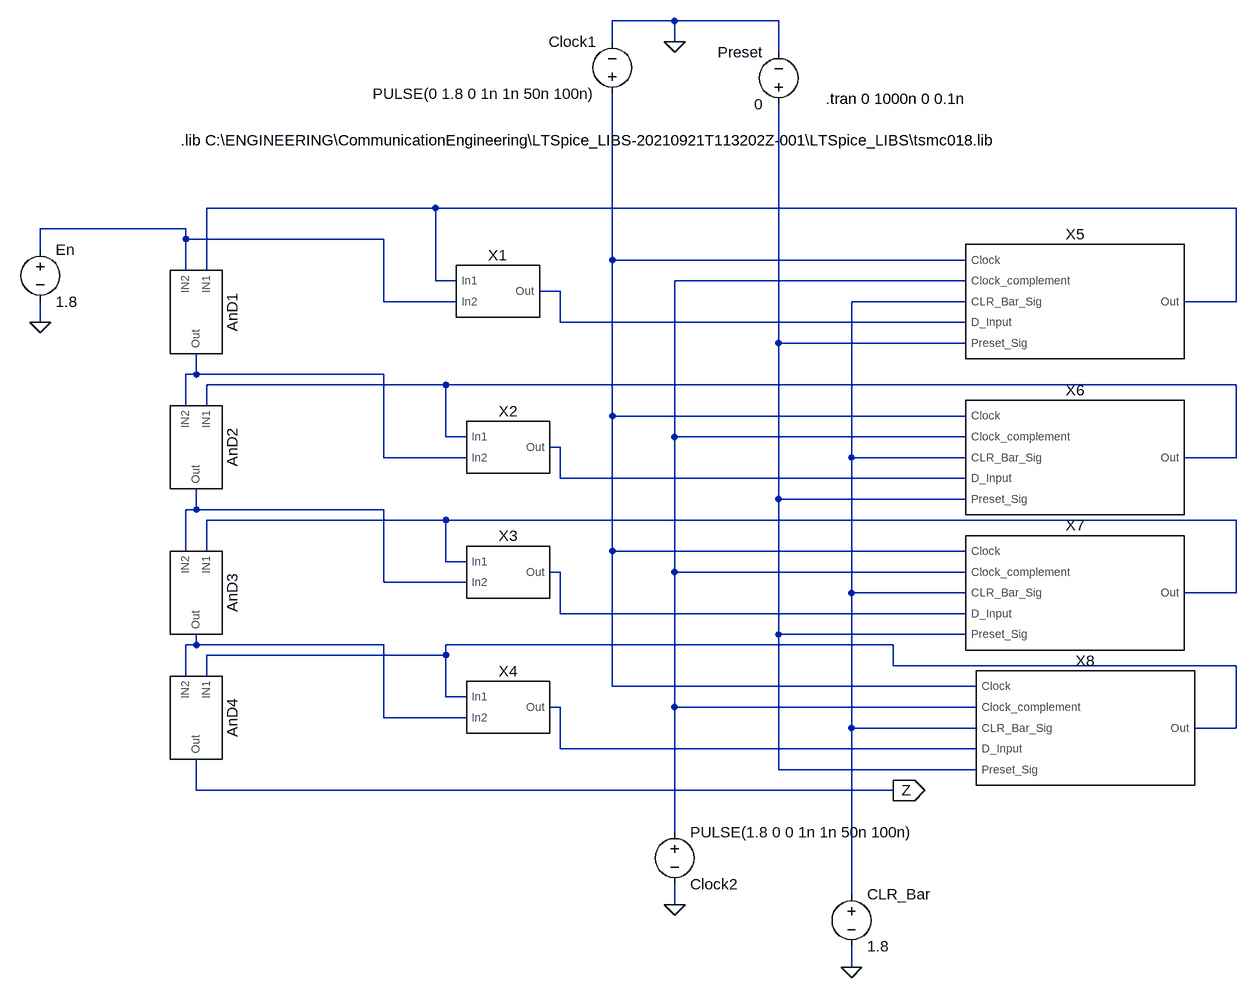
[diagram p0: schematic Counter1.asc]
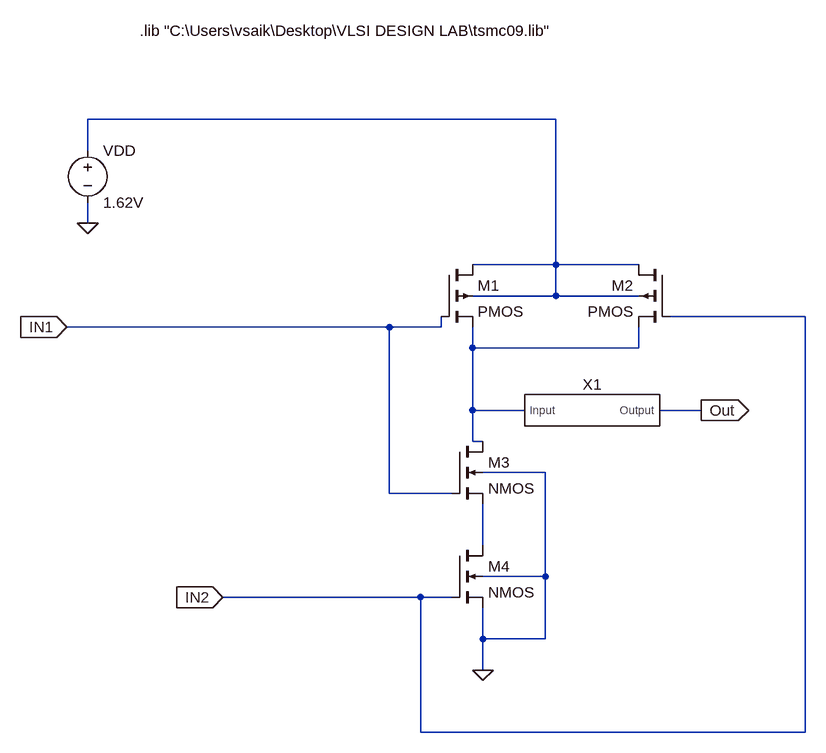
[diagram p1: sub-circuit and_model1.asc]
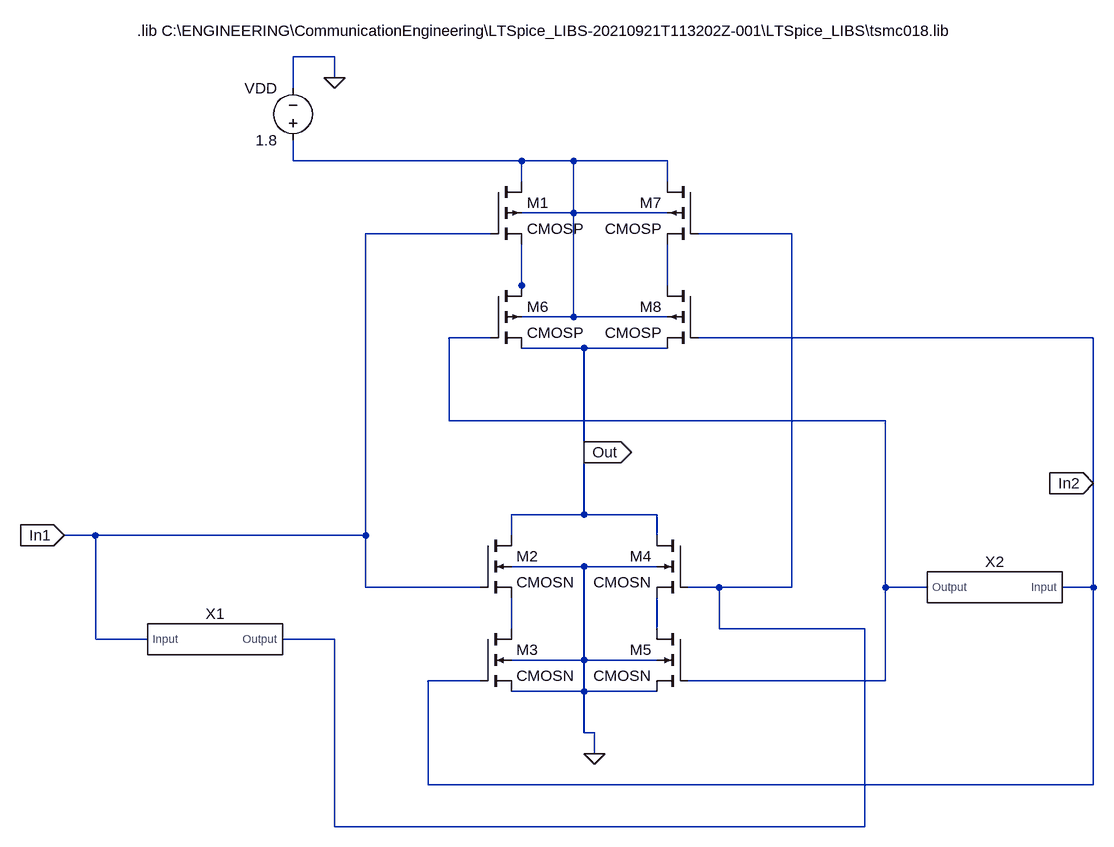
[diagram p2: sub-circuit xor_model1.asc]
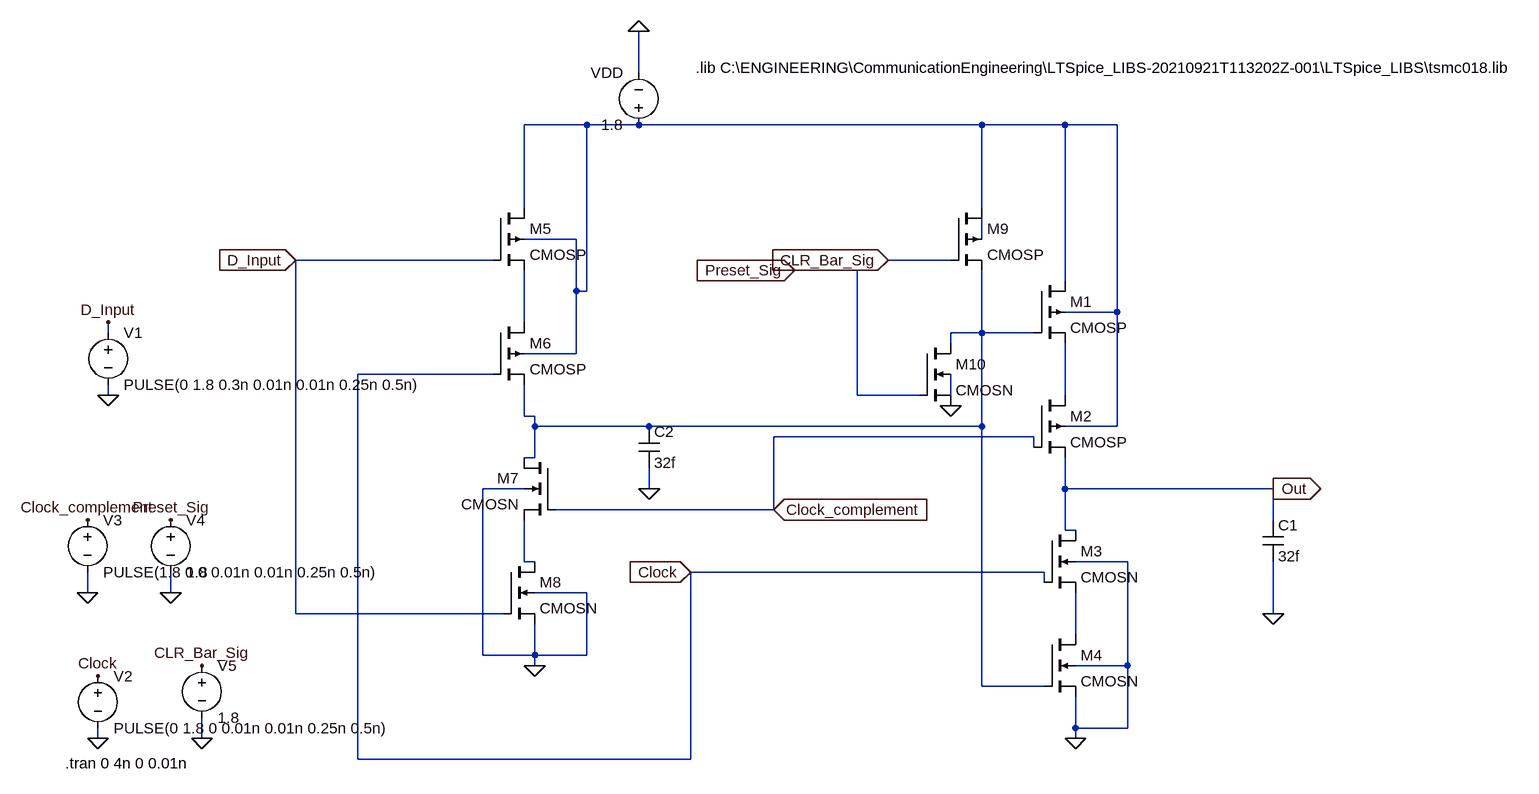
[diagram p3: sub-circuit d_flip_flop_design_pr_clr.asc]
Counter1.asc, the LTspice schematic file:
Version 4
SHEET 1 1284 1268
WIRE 416 -208 320 -208
WIRE 576 -208 416 -208
WIRE 320 -176 320 -208
WIRE 416 -176 416 -208
WIRE 576 -160 576 -208
WIRE 48 80 -304 80
WIRE 1280 80 48 80
WIRE -336 112 -560 112
WIRE -336 128 -336 112
WIRE -32 128 -336 128
WIRE -560 144 -560 112
WIRE 320 160 320 -96
WIRE 864 160 320 160
WIRE -336 176 -336 128
WIRE -304 176 -304 80
WIRE 48 192 48 80
WIRE 80 192 48 192
WIRE 864 192 416 192
WIRE 240 208 208 208
WIRE -32 224 -32 128
WIRE 80 224 -32 224
WIRE 864 224 688 224
WIRE 1280 224 1280 80
WIRE 1280 224 1200 224
WIRE -560 256 -560 224
WIRE 240 256 240 208
WIRE 864 256 240 256
WIRE 576 288 576 -80
WIRE 864 288 576 288
WIRE -320 336 -320 304
WIRE -320 336 -336 336
WIRE -32 336 -320 336
WIRE 64 352 -304 352
WIRE 1280 352 64 352
WIRE -336 384 -336 336
WIRE -304 384 -304 352
WIRE 320 400 320 160
WIRE 864 400 320 400
WIRE 64 432 64 352
WIRE 96 432 64 432
WIRE 416 432 416 192
WIRE 864 432 416 432
WIRE 240 448 224 448
WIRE -32 464 -32 336
WIRE 96 464 -32 464
WIRE 688 464 688 224
WIRE 864 464 688 464
WIRE 1280 464 1280 352
WIRE 1280 464 1200 464
WIRE 240 496 240 448
WIRE 864 496 240 496
WIRE 576 528 576 288
WIRE 864 528 576 528
WIRE -320 544 -320 512
WIRE -320 544 -336 544
WIRE -32 544 -320 544
WIRE 64 560 -304 560
WIRE 1280 560 64 560
WIRE -336 608 -336 544
WIRE -304 608 -304 560
WIRE 320 608 320 400
WIRE 864 608 320 608
WIRE 64 624 64 560
WIRE 96 624 64 624
WIRE 240 640 224 640
WIRE 416 640 416 432
WIRE 864 640 416 640
WIRE -32 656 -32 544
WIRE 96 656 -32 656
WIRE 688 672 688 464
WIRE 864 672 688 672
WIRE 1280 672 1280 560
WIRE 1280 672 1200 672
WIRE 240 704 240 640
WIRE 864 704 240 704
WIRE 576 736 576 528
WIRE 864 736 576 736
WIRE -320 752 -320 736
WIRE -320 752 -336 752
WIRE -32 752 -320 752
WIRE 752 752 64 752
WIRE 64 768 64 752
WIRE 64 768 -304 768
WIRE 752 784 752 752
WIRE 1280 784 752 784
WIRE -336 800 -336 752
WIRE -304 800 -304 768
WIRE 320 816 320 608
WIRE 880 816 320 816
WIRE 64 832 64 768
WIRE 96 832 64 832
WIRE 240 848 224 848
WIRE 416 848 416 640
WIRE 880 848 416 848
WIRE -32 864 -32 752
WIRE 96 864 -32 864
WIRE 688 880 688 672
WIRE 880 880 688 880
WIRE 1280 880 1280 784
WIRE 1280 880 1216 880
WIRE 240 912 240 848
WIRE 880 912 240 912
WIRE 576 944 576 736
WIRE 880 944 576 944
WIRE -320 976 -320 928
WIRE 752 976 -320 976
WIRE 416 1040 416 848
WIRE 688 1136 688 880
WIRE 416 1152 416 1120
WIRE 688 1248 688 1216
FLAG -560 256 0
FLAG 416 -176 0
FLAG 752 976 Z
IOPIN 752 976 Out
FLAG 416 1152 0
FLAG 688 1248 0
SYMBOL AND_model1 -320 240 R90
SYMATTR InstName AnD1
SYMBOL AND_model1 -320 448 R90
SYMATTR InstName AnD2
SYMBOL AND_model1 -320 672 R90
SYMATTR InstName AnD3
SYMBOL AND_model1 -320 864 R90
SYMATTR InstName AnD4
SYMBOL XOR_model1 144 208 R0
SYMATTR InstName X1
SYMBOL XOR_model1 160 448 R0
SYMATTR InstName X2
SYMBOL XOR_model1 160 640 R0
SYMATTR InstName X3
SYMBOL XOR_model1 160 848 R0
SYMATTR InstName X4
SYMBOL voltage -560 128 R0
SYMATTR InstName En
SYMATTR Value 1.8
SYMBOL voltage 320 -80 R180
WINDOW 0 24 96 Left 2
WINDOW 3 24 16 Left 2
WINDOW 123 0 0 Left 0
WINDOW 39 0 0 Left 0
SYMATTR InstName Clock1
SYMATTR Value PULSE(0 1.8 0 1n 1n 50n 100n)
SYMBOL D_Flip_Flop_design_Pr_Clr 1024 224 R0
SYMATTR InstName X5
SYMBOL D_Flip_Flop_design_Pr_Clr 1024 464 R0
SYMATTR InstName X6
SYMBOL D_Flip_Flop_design_Pr_Clr 1024 672 R0
SYMATTR InstName X7
SYMBOL D_Flip_Flop_design_Pr_Clr 1040 880 R0
SYMATTR InstName X8
SYMBOL voltage 416 1024 R0
WINDOW 0 24 96 Left 2
WINDOW 3 24 16 Left 2
WINDOW 123 0 0 Left 0
WINDOW 39 0 0 Left 0
SYMATTR InstName Clock2
SYMATTR Value PULSE(1.8 0 0 1n 1n 50n 100n)
SYMBOL voltage 688 1120 R0
SYMATTR InstName CLR_Bar
SYMATTR Value 1.8
SYMBOL voltage 576 -64 R180
WINDOW 0 24 96 Left 2
WINDOW 3 24 16 Left 2
WINDOW 123 0 0 Left 0
WINDOW 39 0 0 Left 0
SYMATTR InstName Preset
SYMATTR Value 0
TEXT -344 -24 Left 2 !.lib C:\\ENGINEERING\\CommunicationEngineering\\LTSpice_LIBS-20210921T113202Z-001\\LTSpice_LIBS\\tsmc018.lib
TEXT 648 -88 Left 2 !.tran 0 1000n 0 0.1n

and_model1.asc, the sub-circuit schematic file:
Version 4
SHEET 1 1644 1012
WIRE 912 64 192 64
WIRE 192 112 192 64
WIRE 192 224 192 192
WIRE 912 288 912 64
WIRE 912 288 784 288
WIRE 1040 288 912 288
WIRE 912 336 912 288
WIRE 912 336 784 336
WIRE 1040 336 912 336
WIRE 1296 368 1088 368
WIRE 656 384 160 384
WIRE 736 384 736 368
WIRE 736 384 656 384
WIRE 784 416 784 384
WIRE 1040 416 1040 384
WIRE 1040 416 784 416
WIRE 784 512 784 416
WIRE 864 512 784 512
WIRE 1136 512 1072 512
WIRE 784 560 784 512
WIRE 800 560 784 560
WIRE 896 608 800 608
WIRE 656 640 656 384
WIRE 752 640 656 640
WIRE 800 720 800 656
WIRE 896 768 896 608
WIRE 896 768 800 768
WIRE 704 800 400 800
WIRE 752 800 704 800
WIRE 800 864 800 816
WIRE 896 864 896 768
WIRE 896 864 800 864
WIRE 800 912 800 864
WIRE 704 1008 704 800
WIRE 1296 1008 1296 368
WIRE 1296 1008 704 1008
FLAG 192 224 0
FLAG 800 912 0
FLAG 1136 512 Out
IOPIN 1136 512 Out
FLAG 160 384 IN1
IOPIN 160 384 In
FLAG 400 800 IN2
IOPIN 400 800 In
SYMBOL pmos4 736 288 R0
SYMATTR InstName M1
SYMATTR Value2 l=90n w=440n
SYMBOL pmos4 1088 288 M0
SYMATTR InstName M2
SYMATTR Value2 l=90n w=440n
SYMBOL nmos4 752 560 R0
SYMATTR InstName M3
SYMATTR Value2 l=90n w=220n
SYMBOL nmos4 752 720 R0
SYMATTR InstName M4
SYMATTR Value2 l=90n w=220n
SYMBOL voltage 192 96 R0
SYMATTR InstName VDD
SYMATTR Value 1.62V
SYMBOL NOT_model1 960 512 R0
SYMATTR InstName X1
TEXT 272 -72 Left 2 !.lib "C:\\Users\\vsaik\\Desktop\\VLSI DESIGN LAB\\tsmc09.lib"

xor_model1.asc, the sub-circuit schematic file:
Version 4
SHEET 1 2196 1236
WIRE 480 48 416 48
WIRE 480 80 480 48
WIRE 416 96 416 48
WIRE 416 208 416 176
WIRE 768 208 416 208
WIRE 848 208 768 208
WIRE 992 208 848 208
WIRE 768 240 768 208
WIRE 992 240 992 208
WIRE 848 288 848 208
WIRE 848 288 768 288
WIRE 992 288 848 288
WIRE 720 320 528 320
WIRE 1184 320 1040 320
WIRE 768 400 768 336
WIRE 992 400 992 336
WIRE 768 416 768 400
WIRE 848 448 848 288
WIRE 848 448 768 448
WIRE 992 448 848 448
WIRE 720 480 656 480
WIRE 1648 480 1040 480
WIRE 864 496 768 496
WIRE 992 496 864 496
WIRE 656 608 656 480
WIRE 1328 608 656 608
WIRE 864 656 864 496
WIRE 1648 704 1648 480
WIRE 864 752 864 656
WIRE 864 752 752 752
WIRE 976 752 864 752
WIRE 112 784 64 784
WIRE 528 784 528 320
WIRE 528 784 112 784
WIRE 752 784 752 752
WIRE 976 784 976 752
WIRE 864 832 752 832
WIRE 976 832 864 832
WIRE 528 864 528 784
WIRE 704 864 528 864
WIRE 1072 864 1024 864
WIRE 1184 864 1184 320
WIRE 1184 864 1072 864
WIRE 1328 864 1328 608
WIRE 1392 864 1328 864
WIRE 1648 864 1648 704
WIRE 1648 864 1600 864
WIRE 752 928 752 880
WIRE 976 928 976 880
WIRE 1072 928 1072 864
WIRE 1296 928 1072 928
WIRE 112 944 112 784
WIRE 192 944 112 944
WIRE 480 944 400 944
WIRE 864 976 864 832
WIRE 864 976 752 976
WIRE 976 976 864 976
WIRE 704 1008 624 1008
WIRE 1328 1008 1328 864
WIRE 1328 1008 1024 1008
WIRE 864 1024 864 976
WIRE 864 1024 752 1024
WIRE 976 1024 864 1024
WIRE 864 1088 864 1024
WIRE 880 1088 864 1088
WIRE 880 1120 880 1088
WIRE 624 1168 624 1008
WIRE 1648 1168 1648 864
WIRE 1648 1168 624 1168
WIRE 480 1232 480 944
WIRE 1296 1232 1296 928
WIRE 1296 1232 480 1232
FLAG 480 80 0
FLAG 880 1120 0
FLAG 64 784 In1
IOPIN 64 784 In
FLAG 1648 704 In2
IOPIN 1648 704 In
FLAG 864 656 Out
IOPIN 864 656 Out
SYMBOL pmos4 720 240 R0
SYMATTR InstName M1
SYMATTR Value CMOSP
SYMATTR Value2 l=180n w=1320n
SYMBOL nmos4 704 784 R0
SYMATTR InstName M2
SYMATTR Value CMOSN
SYMATTR Value2 l=180n w=440n
SYMBOL nmos4 704 928 R0
SYMATTR InstName M3
SYMATTR Value CMOSN
SYMATTR Value2 l=180n w=440n
SYMBOL nmos4 1024 784 M0
SYMATTR InstName M4
SYMATTR Value CMOSN
SYMATTR Value2 l=180n w=440n
SYMBOL nmos4 1024 928 M0
SYMATTR InstName M5
SYMATTR Value CMOSN
SYMATTR Value2 l=180n w=440n
SYMBOL voltage 416 192 R180
WINDOW 0 24 96 Left 2
WINDOW 3 24 16 Left 2
SYMATTR InstName VDD
SYMATTR Value 1.8
SYMBOL pmos4 720 400 R0
SYMATTR InstName M6
SYMATTR Value CMOSP
SYMATTR Value2 l=180n w=1320n
SYMBOL pmos4 1040 240 M0
SYMATTR InstName M7
SYMATTR Value CMOSP
SYMATTR Value2 l=180n w=1320n
SYMBOL pmos4 1040 400 M0
SYMATTR InstName M8
SYMATTR Value CMOSP
SYMATTR Value2 l=180n w=1320n
SYMBOL NOT_model1 288 944 R0
SYMATTR InstName X1
SYMBOL NOT_model1 1504 864 M0
SYMATTR InstName X2
TEXT 176 8 Left 2 !.lib C:\\ENGINEERING\\CommunicationEngineering\\LTSpice_LIBS-20210921T113202Z-001\\LTSpice_LIBS\\tsmc018.lib

d_flip_flop_design_pr_clr.asc, the sub-circuit schematic file:
Version 4
SHEET 1 1324 1064
WIRE -160 -16 -160 -80
WIRE -240 64 -336 64
WIRE -160 64 -240 64
WIRE 368 64 -160 64
WIRE 496 64 368 64
WIRE 576 64 496 64
WIRE -336 192 -336 64
WIRE 368 192 368 64
WIRE -256 240 -336 240
WIRE 368 240 368 208
WIRE -384 272 -688 272
WIRE 320 272 224 272
WIRE 176 288 80 288
WIRE 496 304 496 64
WIRE -256 320 -256 240
WIRE -240 320 -240 64
WIRE -240 320 -256 320
WIRE 576 352 576 64
WIRE 576 352 496 352
WIRE -336 368 -336 288
WIRE -976 384 -976 368
WIRE 368 384 368 288
WIRE 368 384 320 384
WIRE 448 384 368 384
WIRE 320 400 320 384
WIRE -256 416 -256 320
WIRE -256 416 -336 416
WIRE -384 448 -592 448
WIRE -976 480 -976 464
WIRE 176 480 176 288
WIRE 272 480 176 480
WIRE 320 480 320 448
WIRE 496 480 496 400
WIRE -336 512 -336 464
WIRE -320 512 -336 512
WIRE -320 528 -320 512
WIRE -144 528 -320 528
WIRE 368 528 368 384
WIRE 368 528 -144 528
WIRE 576 528 576 352
WIRE 576 528 496 528
WIRE 448 544 48 544
WIRE 448 560 448 544
WIRE -320 576 -320 528
WIRE -320 576 -336 576
WIRE -336 624 -400 624
WIRE -144 624 -144 592
WIRE 496 624 496 576
WIRE 816 624 496 624
WIRE 48 656 48 544
WIRE 48 656 -288 656
WIRE 816 672 816 624
WIRE 496 688 496 624
WIRE 512 688 496 688
WIRE -336 736 -336 672
WIRE -320 736 -336 736
WIRE 592 736 512 736
WIRE 464 752 -80 752
WIRE 464 768 464 752
WIRE -1008 784 -1008 752
WIRE -880 784 -880 752
WIRE -240 784 -320 784
WIRE -688 816 -688 272
WIRE -368 816 -688 816
WIRE 816 816 816 736
WIRE 512 848 512 784
WIRE -400 880 -400 624
WIRE -320 880 -320 832
WIRE -320 880 -400 880
WIRE -240 880 -240 784
WIRE -240 880 -320 880
WIRE -320 896 -320 880
WIRE 592 896 592 736
WIRE 592 896 512 896
WIRE 368 928 368 528
WIRE 464 928 368 928
WIRE 512 992 512 944
WIRE 592 992 592 896
WIRE 592 992 512 992
WIRE -992 1008 -992 992
WIRE -832 1008 -832 976
WIRE 512 1008 512 992
WIRE -592 1040 -592 448
WIRE -80 1040 -80 752
WIRE -80 1040 -592 1040
FLAG -160 -80 0
FLAG 512 1008 0
FLAG 816 816 0
FLAG -320 896 0
FLAG -144 624 0
FLAG 320 496 0
FLAG 80 288 Preset_Sig
IOPIN 80 288 In
FLAG 224 272 CLR_Bar_Sig
IOPIN 224 272 In
FLAG -80 752 Clock
IOPIN -80 752 In
FLAG -688 272 D_Input
IOPIN -688 272 In
FLAG 48 656 Clock_complement
IOPIN 48 656 In
FLAG 816 624 Out
IOPIN 816 624 Out
FLAG -976 480 0
FLAG -992 1008 0
FLAG -1008 784 0
FLAG -880 784 0
FLAG -976 368 D_Input
FLAG -992 912 Clock
FLAG -1008 672 Clock_complement
FLAG -880 672 Preset_Sig
FLAG -832 1008 0
FLAG -832 896 CLR_Bar_Sig
SYMBOL pmos4 448 304 R0
SYMATTR InstName M1
SYMATTR Value CMOSP
SYMATTR Value2 l=180n w=440n
SYMBOL pmos4 448 480 R0
SYMATTR InstName M2
SYMATTR Value CMOSP
SYMATTR Value2 l=180n w=440n
SYMBOL nmos4 464 688 R0
SYMATTR InstName M3
SYMATTR Value CMOSN
SYMATTR Value2 l=180n w=220n
SYMBOL nmos4 464 848 R0
SYMATTR InstName M4
SYMATTR Value CMOSN
SYMATTR Value2 l=180n w=220n
SYMBOL voltage -160 80 R180
WINDOW 0 24 96 Left 2
WINDOW 3 24 16 Left 2
SYMATTR InstName VDD
SYMATTR Value 1.8
SYMBOL cap 800 672 R0
SYMATTR InstName C1
SYMATTR Value 32f
SYMBOL pmos4 -384 192 R0
SYMATTR InstName M5
SYMATTR Value CMOSP
SYMATTR Value2 l=180n w=440n
SYMBOL pmos4 -384 368 R0
SYMATTR InstName M6
SYMATTR Value CMOSP
SYMATTR Value2 l=180n w=440n
SYMBOL nmos4 -288 576 M0
SYMATTR InstName M7
SYMATTR Value CMOSN
SYMATTR Value2 l=180n w=220n
SYMBOL nmos4 -368 736 R0
SYMATTR InstName M8
SYMATTR Value CMOSN
SYMATTR Value2 l=180n w=220n
SYMBOL cap -160 528 R0
SYMATTR InstName C2
SYMATTR Value 32f
SYMBOL pmos4 320 192 R0
SYMATTR InstName M9
SYMATTR Value CMOSP
SYMATTR Value2 l=180n w=440n
SYMBOL nmos4 272 400 R0
SYMATTR InstName M10
SYMATTR Value CMOSN
SYMATTR Value2 l=180n w=220n
SYMBOL voltage -976 368 R0
WINDOW 123 0 0 Left 0
WINDOW 39 0 0 Left 0
SYMATTR InstName V1
SYMATTR Value PULSE(0 1.8 0.3n 0.01n 0.01n 0.25n 0.5n)
SYMBOL voltage -992 896 R0
WINDOW 123 0 0 Left 0
WINDOW 39 0 0 Left 0
SYMATTR InstName V2
SYMATTR Value PULSE(0 1.8 0 0.01n 0.01n 0.25n 0.5n)
SYMBOL voltage -1008 656 R0
WINDOW 123 0 0 Left 0
WINDOW 39 0 0 Left 0
SYMATTR InstName V3
SYMATTR Value PULSE(1.8 0 0 0.01n 0.01n 0.25n 0.5n)
SYMBOL voltage -880 656 R0
WINDOW 123 0 0 Left 0
WINDOW 39 0 0 Left 0
SYMATTR InstName V4
SYMATTR Value 1.8
SYMBOL voltage -832 880 R0
WINDOW 123 0 0 Left 0
WINDOW 39 0 0 Left 0
SYMATTR InstName V5
SYMATTR Value 1.8
TEXT -72 -24 Left 2 !.lib C:\\ENGINEERING\\CommunicationEngineering\\LTSpice_LIBS-20210921T113202Z-001\\LTSpice_LIBS\\tsmc018.lib
TEXT -1042 1046 Left 2 !.tran 0 4n 0 0.01n

The netlist it stands for:
* Counter1.asc
XAnD1 N001 N002 N008 and_model1
XAnD2 N009 N008 N011 and_model1
XAnD3 N012 N011 N014 and_model1
XAnD4 N015 N014 Z and_model1
XX1 N001 N002 N005 xor_model1
XX2 N009 N008 N010 xor_model1
XX3 N012 N011 N013 xor_model1
XX4 N015 N014 N016 xor_model1
V§En N002 0 1.8
V§Clock1 N003 0 PULSE(0 1.8 0 1n 1n 50n 100n)
XX5 N003 N004 N006 N005 N007 N001 d_flip_flop_design_pr_clr
XX6 N003 N004 N006 N010 N007 N009 d_flip_flop_design_pr_clr
XX7 N003 N004 N006 N013 N007 N012 d_flip_flop_design_pr_clr
XX8 N003 N004 N006 N016 N007 N015 d_flip_flop_design_pr_clr
V§Clock2 N004 0 PULSE(1.8 0 0 1n 1n 50n 100n)
V§CLR_Bar N006 0 1.8
V§Preset N007 0 0

* block symbol definitions
.subckt and_model1 IN1 IN2 Out
M1 N001 IN1 N002 N001 PMOS l=90n w=440n
M2 N001 IN2 N002 N001 PMOS l=90n w=440n
M3 N002 IN1 N003 0 NMOS l=90n w=220n
M4 N003 IN2 0 0 NMOS l=90n w=220n
VDD N001 0 1.62V
XX1 N002 Out NOT0  ; pins Input Output
.lib "C:\Users\vsaik\Desktop\VLSI DESIGN LAB\tsmc09.lib"
.ends and_model1

.subckt xor_model1 In1 In2 Out
M1 N001 In1 N003 N001 CMOSP l=180n w=1320n
M2 Out In1 N006 0 CMOSN l=180n w=440n
M3 N006 In2 0 0 CMOSN l=180n w=440n
M4 Out N002 N007 0 CMOSN l=180n w=440n
M5 N007 N005 0 0 CMOSN l=180n w=440n
VDD N001 0 1.8
M6 N003 N005 Out N001 CMOSP l=180n w=1320n
M7 N001 N002 N004 N001 CMOSP l=180n w=1320n
M8 N004 In2 Out N001 CMOSP l=180n w=1320n
XX1 In1 N002 NOT0  ; pins Input Output
XX2 In2 N005 NOT0  ; pins Input Output
.lib C:\ENGINEERING\CommunicationEngineering\LTSpice_LIBS-20210921T113202Z-001\LTSpice_LIBS\tsmc018.lib
.ends xor_model1

.subckt d_flip_flop_design_pr_clr Clock Clock_complement CLR_Bar_Sig D_Input Preset_Sig Out
M1 N001 N004 N006 N001 CMOSP l=180n w=440n
M2 N006 Clock_complement Out N001 CMOSP l=180n w=440n
M3 Out Clock N008 0 CMOSN l=180n w=220n
M4 N008 N004 0 0 CMOSN l=180n w=220n
VDD N001 0 1.8
C1 Out 0 32f
M5 N001 D_Input N003 N001 CMOSP l=180n w=440n
M6 N003 Clock N004 N001 CMOSP l=180n w=440n
M7 N004 Clock_complement N007 0 CMOSN l=180n w=220n
M8 N007 D_Input 0 0 CMOSN l=180n w=220n
C2 N004 0 32f
M9 N001 CLR_Bar_Sig N004 N002 CMOSP l=180n w=440n
M10 N004 Preset_Sig 0 N005 CMOSN l=180n w=220n
V1 D_Input 0 PULSE(0 1.8 0.3n 0.01n 0.01n 0.25n 0.5n)
V2 Clock 0 PULSE(0 1.8 0 0.01n 0.01n 0.25n 0.5n)
V3 Clock_complement 0 PULSE(1.8 0 0 0.01n 0.01n 0.25n 0.5n)
V4 Preset_Sig 0 1.8
V5 CLR_Bar_Sig 0 1.8
.lib C:\ENGINEERING\CommunicationEngineering\LTSpice_LIBS-20210921T113202Z-001\LTSpice_LIBS\tsmc018.lib
.tran 0 4n 0 0.01n
.ends d_flip_flop_design_pr_clr

.model NMOS NMOS
.model PMOS PMOS
.lib standard.mos
.lib C:\ENGINEERING\CommunicationEngineering\LTSpice_LIBS-20210921T113202Z-001\LTSpice_LIBS\tsmc018.lib
.tran 0 1000n 0 0.1n
.backanno
.end